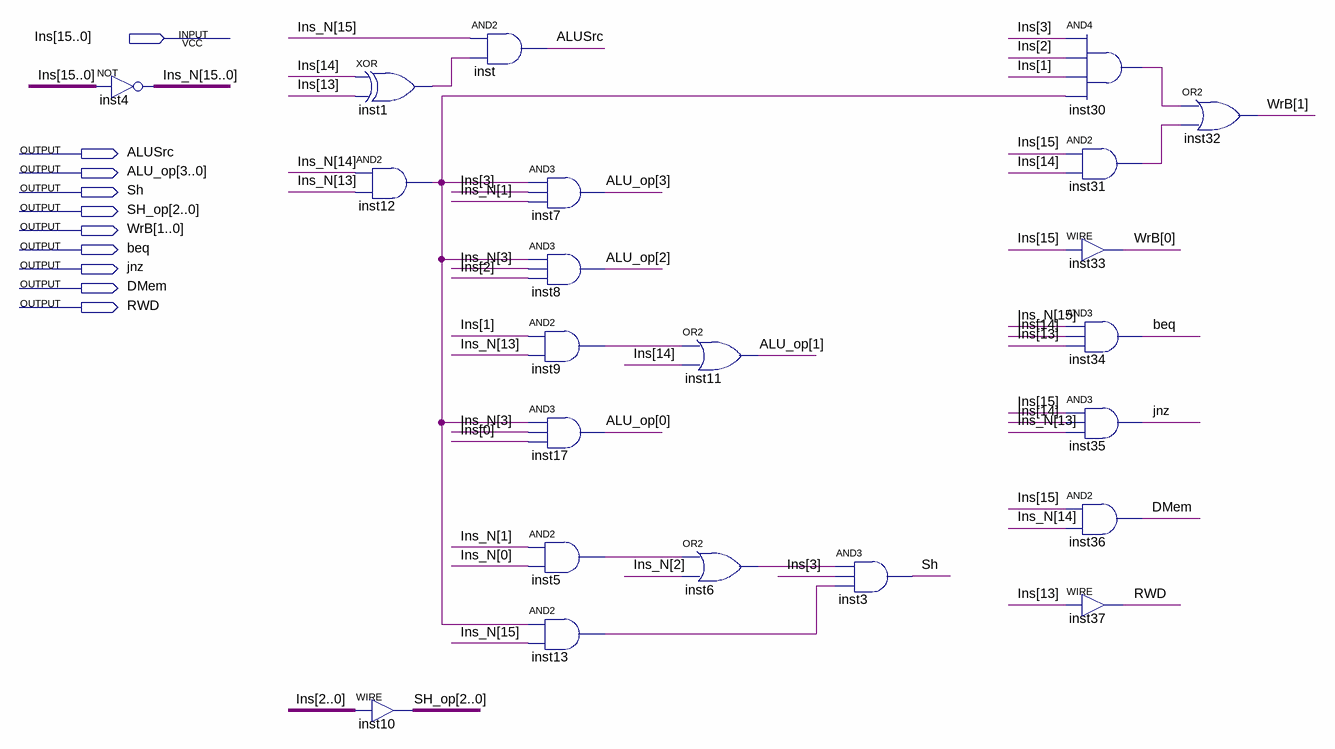
[diagram p0: schematic sheet]
// Quartus schematic Op_Func_Define.bdf as structural Verilog: 22 symbols, 10 pins
module Op_Func_Define (
  input  [15:0] Ins,
  output ALUSrc,
  output [3:0] ALU_op,
  output Sh,
  output [2:0] SH_op,
  output [1:0] WrB,
  output beq,
  output jnz,
  output DMem,
  output RWD
);

  wire inst1_out, inst5_out, inst6_out, inst9_out, inst12_out, inst13_out, inst30_out, inst31_out;
  wire [15:0] Ins_N;

  assign Ins_N = ~Ins;  // NOT inst4, 16 bits wide
  xor inst1 (inst1_out, Ins[14], Ins[13]);
  and inst12 (inst12_out, Ins_N[14], Ins_N[13]);
  assign SH_op = Ins[2:0];  // WIRE inst10
  and inst (ALUSrc, Ins_N[15], inst1_out);
  and inst7 (ALU_op[3], inst12_out, Ins[3], Ins_N[1]);
  and inst8 (ALU_op[2], inst12_out, Ins_N[3], Ins[2]);
  and inst9 (inst9_out, Ins[1], Ins_N[13]);
  and inst17 (ALU_op[0], inst12_out, Ins_N[3], Ins[0]);
  and inst5 (inst5_out, Ins_N[1], Ins_N[0]);
  and inst13 (inst13_out, inst12_out, Ins_N[15]);
  or inst11 (ALU_op[1], inst9_out, Ins[14]);
  or inst6 (inst6_out, inst5_out, Ins_N[2]);
  and inst3 (Sh, inst6_out, Ins[3], inst13_out);
  and inst30 (inst30_out, Ins[3], Ins[2], Ins[1], inst12_out);
  and inst31 (inst31_out, Ins[15], Ins[14]);
  assign WrB[0] = Ins[15];  // WIRE inst33
  and inst34 (beq, Ins_N[15], Ins[14], Ins[13]);
  and inst35 (jnz, Ins[15], Ins[14], Ins_N[13]);
  and inst36 (DMem, Ins[15], Ins_N[14]);
  assign RWD = Ins[13];  // WIRE inst37
  or inst32 (WrB[1], inst30_out, inst31_out);
endmodule
